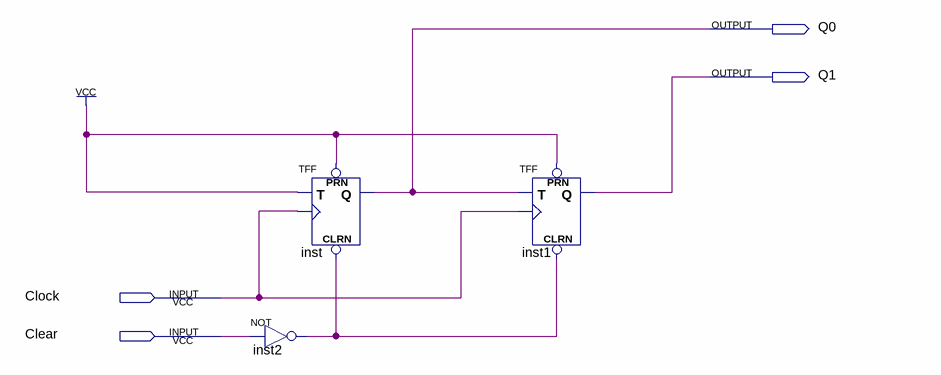
[diagram p0: schematic sheet]
// Quartus schematic 2BitUpCounter.bdf as structural Verilog: 3 symbols, 4 pins
module \2BitUpCounter  (
  input  Clock,
  input  Clear,
  output Q0,
  output Q1
);

  wire inst2_out;

  not inst2 (inst2_out, Clear);
  TFF inst (.PRN(1'b1), .CLRN(inst2_out), .T(1'b1), .CLK(Clock), .Q(Q0));
  TFF inst1 (.PRN(1'b1), .CLRN(inst2_out), .T(Q0), .CLK(Clock), .Q(Q1));
endmodule
